# Altium schematic sheet 2_hub.SchDoc
size A
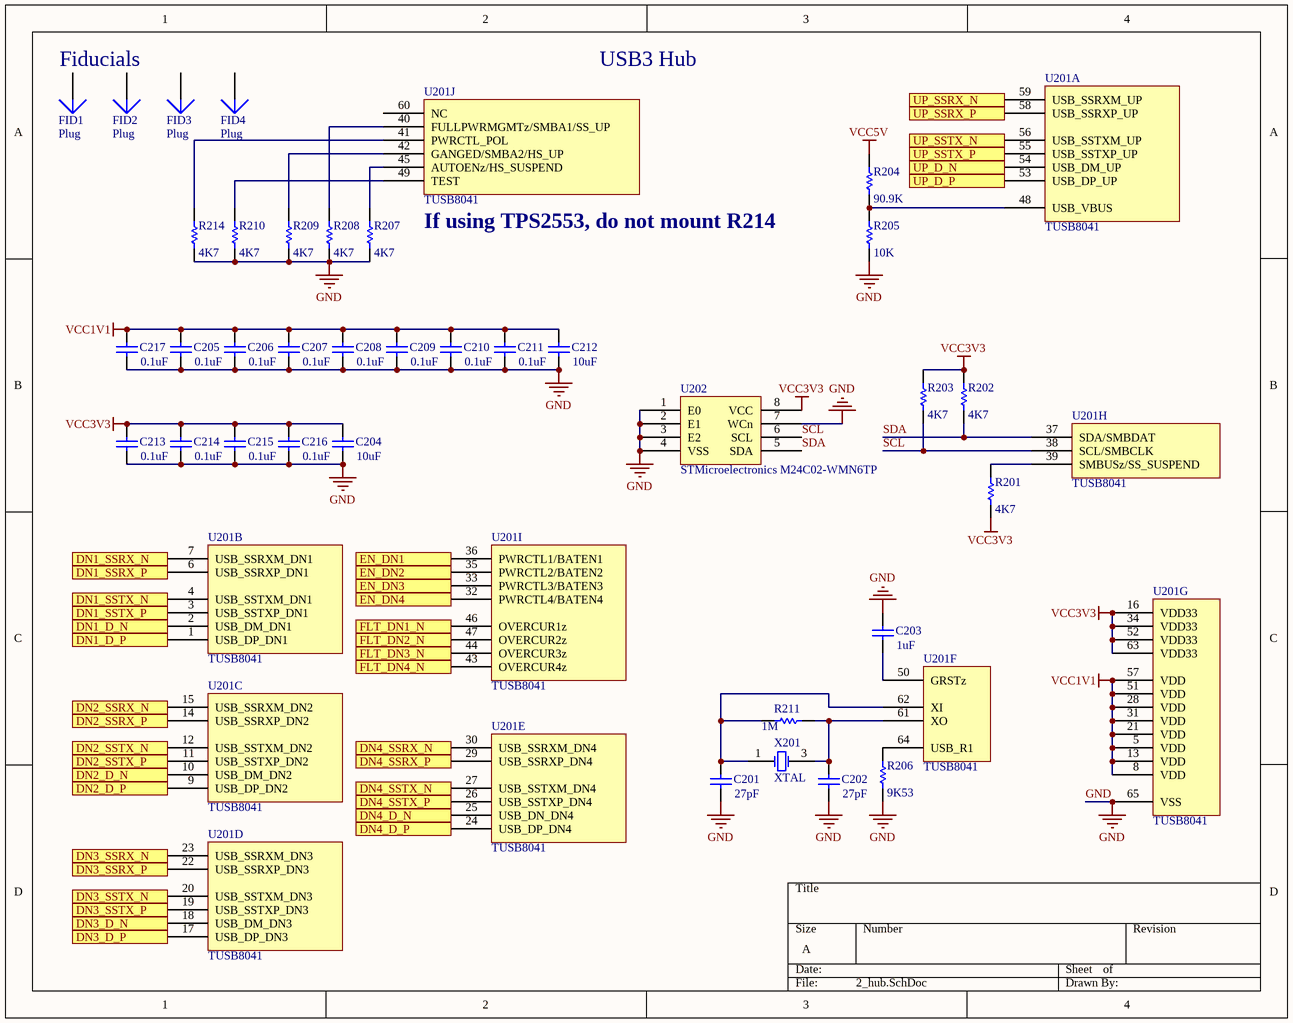
[diagram p0: 2_hub.SchDoc]

## Parts
C201  value 27pF  [C0603[1608]]
C202  value 27pF  [C0603[1608]]
C203  value 1uF  [C0603[1608]]
C204  value 10uF  [C1206[3216]]
C205  value 0.1uF  [C0402[1005]]
C206  value 0.1uF  [C0402[1005]]
C207  value 0.1uF  [C0402[1005]]
C208  value 0.1uF  [C0402[1005]]
C209  value 0.1uF  [C0402[1005]]
C210  value 0.1uF  [C0603[1608]]
C211  value 0.1uF  [C0603[1608]]
C212  value 10uF  [C1206[3216]]
C213  value 0.1uF  [C0402[1005]]
C214  value 0.1uF  [C0603[1608]]
C215  value 0.1uF  [C0603[1608]]
C216  value 0.1uF  [C0603[1608]]
C217  value 0.1uF  [C0402[1005]]
FID1  Plug  [Fiducial_Nordic]  (no BOM)
FID2  Plug  [Fiducial_Nordic]  (no BOM)
FID3  Plug  [Fiducial_Nordic]  (no BOM)
FID4  Plug  [Fiducial_Nordic]  (no BOM)
R201  value 4K7  [R0603[1608]]
R202  value 4K7  [R0603[1608]]
R203  value 4K7  [R0603[1608]]
R204  value 90.9K  [R0603[1608]]
R205  value 10K  [R0603[1608]]
R206  value 9K53  [R0402[1005]]
R207  value 4K7  [R0603[1608]]
R208  value 4K7  [R0603[1608]]
R209  value 4K7  [R0603[1608]]
R210  value 4K7  [R0603[1608]]
R211  value 1M  [R0603[1608]]  (no BOM)
R214  value 4K7  [R0603[1608]]
U201  TUSB8041  [TUSB8041_VQFN]  (parts A,B,C,D,E,F,G,H,I,J of 10)
U202  STMicroelectronics M24C02-WMN6TP  [STMicroelectronics M24C02-WMN6TP]
X201  XTAL  [XTAL-3225]

## Ports
DN1_D_N, DN1_D_P, DN1_SSRX_N, DN1_SSRX_P, DN1_SSTX_N, DN1_SSTX_P, DN2_D_N, DN2_D_P, DN2_SSRX_N, DN2_SSRX_P, DN2_SSTX_N, DN2_SSTX_P, DN3_D_N, DN3_D_P, DN3_SSRX_N, DN3_SSRX_P, DN3_SSTX_N, DN3_SSTX_P, DN4_D_N, DN4_D_P, DN4_SSRX_N, DN4_SSRX_P, DN4_SSTX_N, DN4_SSTX_P, EN_DN1, EN_DN2, EN_DN3, EN_DN4, FLT_DN1_N, FLT_DN2_N, FLT_DN3_N, FLT_DN4_N, UP_D_N, UP_D_P, UP_SSRX_N, UP_SSRX_P, UP_SSTX_N, UP_SSTX_P

## Nets
GND: C201.1 C202.1 C203.2 C204.1 C205.1 C206.1 C207.1 C208.1 C209.1 C210.1 C211.1 C212.1 C213.1 C214.1 C215.1 C216.1 C217.1 R205.2 R206.1 R207.1 R208.1 R209.1 R210.1 R214.1 U201.65(VSS) U202.1(E0) U202.2(E1) U202.3(E2) U202.4(VSS) U202.7(WCn) X201.2(GND) X201.4(GND)
VCC1V1: C205.2 C206.2 C207.2 C208.2 C209.2 C210.2 C211.2 C212.2 C217.2 U201.5(VDD) U201.8(VDD) U201.13(VDD) U201.21(VDD) U201.28(VDD) U201.31(VDD) U201.51(VDD) U201.57(VDD)
VCC3V3: C204.2 C213.2 C214.2 C215.2 C216.2 R201.1 R202.2 R203.2 U201.16(VDD33) U201.34(VDD33) U201.52(VDD33) U201.63(VDD33) U202.8(VCC)
VCC5V: R204.2
DN1_D_N: U201.2(USB_DM_DN1) ; port DN1_D_N
DN1_D_P: U201.1(USB_DP_DN1) ; port DN1_D_P
DN1_SSRX_N: U201.7(USB_SSRXM_DN1) ; port DN1_SSRX_N
DN1_SSRX_P: U201.6(USB_SSRXP_DN1) ; port DN1_SSRX_P
DN1_SSTX_N: U201.4(USB_SSTXM_DN1) ; port DN1_SSTX_N
DN1_SSTX_P: U201.3(USB_SSTXP_DN1) ; port DN1_SSTX_P
DN2_D_N: U201.10(USB_DM_DN2) ; port DN2_D_N
DN2_D_P: U201.9(USB_DP_DN2) ; port DN2_D_P
DN2_SSRX_N: U201.15(USB_SSRXM_DN2) ; port DN2_SSRX_N
DN2_SSRX_P: U201.14(USB_SSRXP_DN2) ; port DN2_SSRX_P
DN2_SSTX_N: U201.12(USB_SSTXM_DN2) ; port DN2_SSTX_N
DN2_SSTX_P: U201.11(USB_SSTXP_DN2) ; port DN2_SSTX_P
DN3_D_N: U201.18(USB_DM_DN3) ; port DN3_D_N
DN3_D_P: U201.17(USB_DP_DN3) ; port DN3_D_P
DN3_SSRX_N: U201.23(USB_SSRXM_DN3) ; port DN3_SSRX_N
DN3_SSRX_P: U201.22(USB_SSRXP_DN3) ; port DN3_SSRX_P
DN3_SSTX_N: U201.20(USB_SSTXM_DN3) ; port DN3_SSTX_N
DN3_SSTX_P: U201.19(USB_SSTXP_DN3) ; port DN3_SSTX_P
DN4_D_N: U201.25(USB_DN_DN4) ; port DN4_D_N
DN4_D_P: U201.24(USB_DP_DN4) ; port DN4_D_P
DN4_SSRX_N: U201.30(USB_SSRXM_DN4) ; port DN4_SSRX_N
DN4_SSRX_P: U201.29(USB_SSRXP_DN4) ; port DN4_SSRX_P
DN4_SSTX_N: U201.27(USB_SSTXM_DN4) ; port DN4_SSTX_N
DN4_SSTX_P: U201.26(USB_SSTXP_DN4) ; port DN4_SSTX_P
EN_DN1: U201.36(PWRCTL1/BATEN1) ; port EN_DN1
EN_DN2: U201.35(PWRCTL2/BATEN2) ; port EN_DN2
EN_DN3: U201.33(PWRCTL3/BATEN3) ; port EN_DN3
EN_DN4: U201.32(PWRCTL4/BATEN4) ; port EN_DN4
FLT_DN1_N: U201.46(OVERCUR1z) ; port FLT_DN1_N
FLT_DN2_N: U201.47(OVERCUR2z) ; port FLT_DN2_N
FLT_DN3_N: U201.44(OVERCUR3z) ; port FLT_DN3_N
FLT_DN4_N: U201.43(OVERCUR4z) ; port FLT_DN4_N
SCL: R203.1 U201.38(SCL/SMBCLK) U202.6(SCL)
SDA: R202.1 U201.37(SDA/SMBDAT) U202.5(SDA)
UP_D_N: U201.54(USB_DM_UP) ; port UP_D_N
UP_D_P: U201.53(USB_DP_UP) ; port UP_D_P
UP_SSRX_N: U201.59(USB_SSRXM_UP) ; port UP_SSRX_N
UP_SSRX_P: U201.58(USB_SSRXP_UP) ; port UP_SSRX_P
UP_SSTX_N: U201.56(USB_SSTXM_UP) ; port UP_SSTX_N
UP_SSTX_P: U201.55(USB_SSTXP_UP) ; port UP_SSTX_P
NetC201_2: C201.2 R211.1 U201.62(XI) X201.1(OSC1)
NetC202_2: C202.2 R211.2 U201.61(XO) X201.3(OSC2)
NetC203_1: C203.1 U201.50(GRSTz)
NetR201_2: R201.2 U201.39(SMBUSz/SS_SUSPEND)
NetR204_1: R204.1 R205.1 U201.48(USB_VBUS)
NetR206_2: R206.2 U201.64(USB_R1)
NetR207_2: R207.2 U201.45(AUTOENz/HS_SUSPEND)
NetR208_2: R208.2 U201.40(FULLPWRMGMTz/SMBA1/SS_UP)
NetR209_2: R209.2 U201.42(GANGED/SMBA2/HS_UP)
NetR210_2: R210.2 U201.49(TEST)
NetR214_2: R214.2 U201.41(PWRCTL_POL)

Not connected (* = marked no-connect by the designer): FID1 1; FID2 1; FID3 1; FID4 1; U201 60(NC)

## Notes on the sheet
- Fiducials
- USB3 Hub
- (near U201) If using TPS2553, do not mount R214

## Library data of the parts
C201 C202 = Cap: Capacitor; MRF.Part: CL10C270JB8NNNC; LCSC MFG: Samsung Electro-Mechanics; Version: 0603 imperial; JLC: BASIC; LCSC Part #: C1656
C203 = Cap: Capacitor; MRF.Part: CL10A105KB8NNNC; MFG: KEMET; MFGPN: C0603C105K4RACTU; LCSC MFG: Samsung Electro-Mechanics; Version: 0603 imperial; JLC: BASIC; LCSC Part #: C15849
C204 C212 = Cap: Capacitor; MRF.Part: CL31A106KBHNNNE; MFG: KEMET; MFGPN: C1206C106K4PACTU; LCSC MFG: Samsung Electro-Mechanics; Version: 1206 imperial; JLC: BASIC; LCSC Part #: C13585
C205-C209 C213 C217 = Cap: Capacitor; MRF.Part: CL05B104KO5NNNC; MFG: KEMET; MFGPN: C0402C104K8PACTU; LCSC MFG: Samsung Electro-Mechanics; Version: 0402 imperial; JLC: BASIC; LCSC Part #: C1525
C210 C211 C214-C216 = Cap: Capacitor; MRF.Part: CC0603KRX7R9BB104; MFG: KEMET; MFGPN: C0603C104M5RACTU; LCSC MFG: YAGEO; Version: 0603 imperial; JLC: BASIC; LCSC Part #: C14663
R201-R203 R207-R210 R214 = Res1: Resistor; MRF.Part: 0603WAF4701T5E; MFG: Vishay Dale; MFGPN: RCA06034K70FKEA; LCSC MFG: Uniroyal Elec; Version: 0603 imperial; JLC: BASIC; LCSC Part #: C23162
R204 = Res1: Resistor; MRF.Part: TC0325D9092T5E; MFG: Vishay Dale; MFGPN: CRCW060390K9FKEA; LCSC MFG: Uniroyal Elec; Version: 0603 imperial; JLC: EXTENDED; LCSC Part #: C51222
R205 = Res1: Resistor; MRF.Part: 0603WAF1002T5E; MFG: Vishay Dale; MFGPN: RCA060310K0FKEA; LCSC MFG: Uniroyal Elec; Version: 0603 imperial; JLC: BASIC; LCSC Part #: C25804
R206 = Res1: Resistor; MRF.Part: 0603WAF9531T5E; MFG: Vishay Dale; MFGPN: CRCW06039K53FKEA; LCSC MFG: Uniroyal Elec; Version: 0603 imperial; JLC: EXTENDED; LCSC Part #: C23127
R211 = Res1: Resistor; MFG: Vishay Dale; MFGPN: RCA06031M00FKEA; LCSC MFG: 0603WAF1004T5E; Version: 0603 imperial; JLC: BASIC; LCSC Part #: C22935; MRF.Part: 0603WAF1004T5E
U201 = TUSB8041: MRF.Part: TUSB8042RGCR; MFG: Texas Instruments; MFGPN: TUSB8042RGCT; LCSC MFG: Texas Instruments; LCSC Part #: C702389; JLC: NONE
U202 = STMicroelectronics M24C02-WMN6TP: Value: 2KB; JLC: BASIC; LCSC MFG: STMicroelectronics; LCSC Part #: C7562; MRF.Part: M24C02-WMN6TP; Version: SO8 2KB
X201 = XTAL: Crystal Oscillator; MRF.Part: X1E0000210264; MFG: EPSON; MFGPN: TSX-3225 24.0000MF18X-C0; Value: 24MHZ; LCSC MFG: Seiko Epson; Version: 3225, 18pF; LCSC Part #: C91744; JLC: EXTENDED
FID1-FID4 = Plug: JLC: DNP